# EAGLE schematic czujnik (EAGLE 9.7.0)
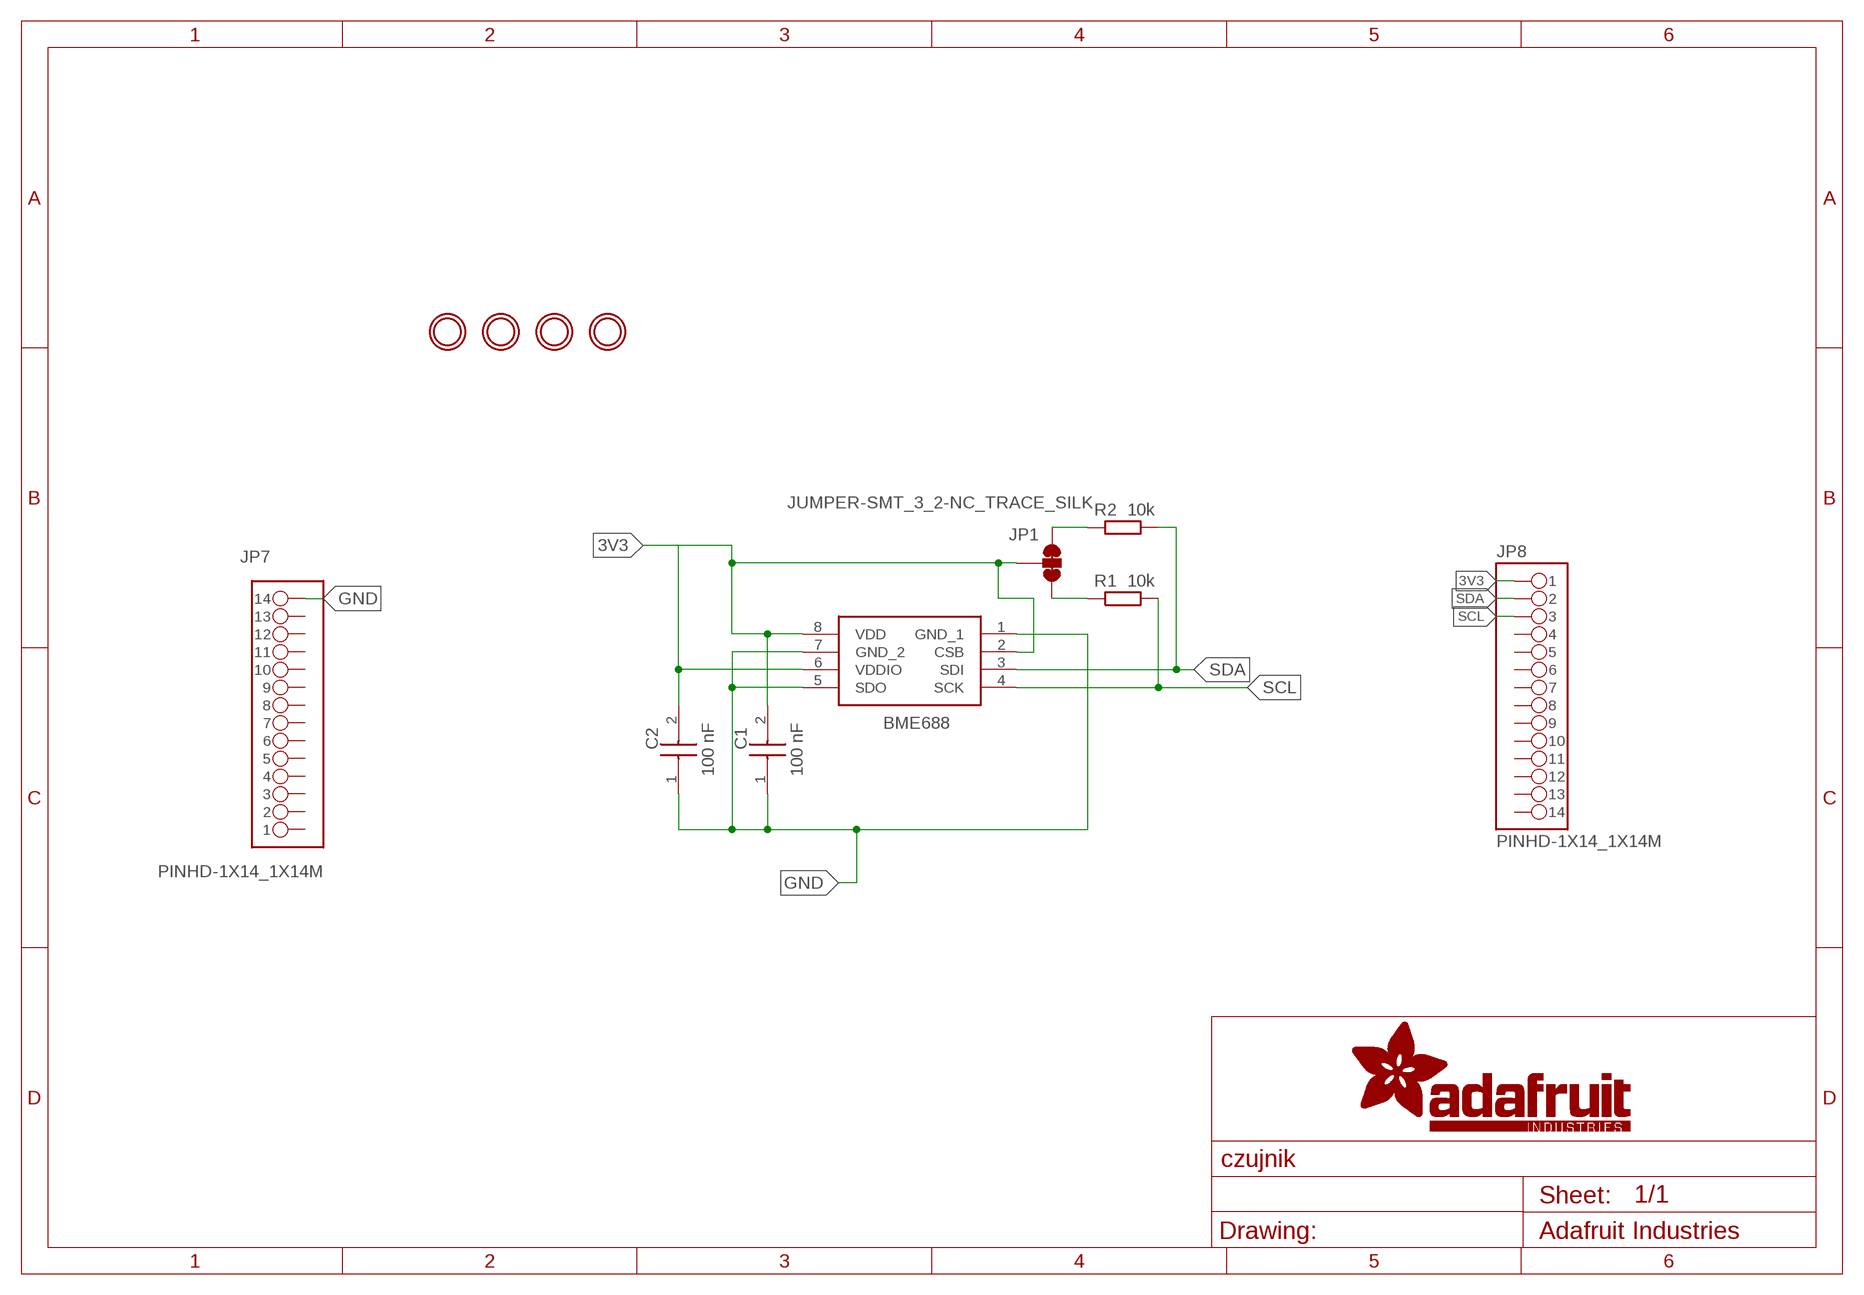
[diagram p0: schematic, sheet 1]

## Parts
BME688  BME688  [BME688]
C1  C0603X104K1RACTU  [CAPC1608X100N]
C2  C0603X104K1RACTU  [CAPC1608X100N]
JP1  JUMPER-SMT_3_2-NC_TRACE_SILK  [SMT-JUMPER_3_2-NC_TRACE_SILK]
JP7  PINHD-1X14_1X14M  [1X14]
JP8  PINHD-1X14_1X14M  [1X14]
R1  10k  RESISTOR__CHIP-0402(1005-METRIC)  [RESC1005X40]
R2  10k  RESISTOR__CHIP-0402(1005-METRIC)  [RESC1005X40]
U$2  MOUNTINGHOLE2.5  [MOUNTINGHOLE_2.5_PLATED]
U$3  MOUNTINGHOLE2.5  [MOUNTINGHOLE_2.5_PLATED]
U$4  MOUNTINGHOLE2.5  [MOUNTINGHOLE_2.5_PLATED]
U$6  MOUNTINGHOLE2.5  [MOUNTINGHOLE_2.5_PLATED]

## Nets
3V3 [power]: BME688.2(CSB) BME688.6(VDDIO) BME688.8(VDD) C1.2 C2.2 JP1.2 JP8.1
GND [power]: BME688.1(GND_1) BME688.5(SDO) BME688.7(GND_2) C1.1 C2.1 JP7.14
N$2: JP1.1 R2.1
N$3: JP1.3 R1.1
SCL: BME688.4(SCK) JP8.3 R1.2
SDA: BME688.3(SDI) JP8.2 R2.2
Unconnected: JP7.1 JP7.2 JP7.3 JP7.4 JP7.5 JP7.6 JP7.7 JP7.8 JP7.9 JP7.10 JP7.11 JP7.12 JP7.13 JP8.4 JP8.5 JP8.6 JP8.7 JP8.8 JP8.9 JP8.10 JP8.11 JP8.12 JP8.13 JP8.14

## Library data of the parts
BME688 = BME688:BME688: Gas sensor measuring relative humidity, barometric pressure, ambient temperature and gas (VOC) Source: Datasheet <https://www.bosch-sensortec.com/media/boschsensortec/downloads/datasheets/bst-bme688-ds000.pdf>; DESCRIPTION: Gas sensor measuring relative humidity, barometric pressure, ambient temperature and gas (VOC); HEIGHT: 1mm; MANUFACTURER_NAME: BOSCH; MANUFACTURER_PART_NUMBER: BME688; MOUSER_PART_NUMBER: 262-BME688; MOUSER_PRICE-STOCK: https://www.mouser.co.uk/ProductDetail/Bosch-Sensortec/BME688?qs=IS%252B4QmGtzzqQoVDscqwx3A%3D%3D
C1 C2 = C0603X104K1RACTU:C0603X104K1RACTU: 0.1 F +/-10% 100V Ceramic Capacitor X7R 0603 (1608 Metric) Source: Datasheet <https://search.kemet.com/component-documentation/download/specsheet/C0603X104K1RACTU>; DESCRIPTION: 100 nF; HEIGHT: 1mm; MANUFACTURER_NAME: KEMET; MANUFACTURER_PART_NUMBER: C0603X104K1RACTU; MOUSER_PART_NUMBER: 80-C0603X104K1RACTU; MOUSER_PRICE-STOCK: https://www.mouser.co.uk/ProductDetail/KEMET/C0603X104K1RACTU?qs=ZcfC38r4PovU2DcqPY0qJg%3D%3D
JP1 = SparkFun-Jumpers:JUMPER-SMT_3_2-NC_TRACE: Normally closed trace jumper (2 of 2 connections) This jumper has a trace between all three pads so they are normally closed (NC). Use a razor knife to open the connection(s). For best results follow the IPC guidelines for cutting traces: Cutout at least 0.063 mm (0.005 in). Remove all loose material to clean up the cut area. Seal the cut with an approved epoxy. Reapply solder to reclose the connection(s).
JP7 JP8 = Tinkercad:PINHD-1X14
R1 R2 = Tinkercad:RESISTOR: Resistor Fixed - Generic; CATEGORY: Resistor; SUB-CATEGORY: Fixed
U$2-U$4 U$6 = microbuilder:MOUNTINGHOLE: Mounting Hole For #2 screws (0.086"/2.18mm width, 0.094"/2.4mm hole) use 2.5mm; BOM: EXCLUDE

## Net classes
0 default: width 0.381 mm
1 power: width 0.711 mm